# EAGLE design SuperTiny-REV4 (EAGLE 9.5.2)
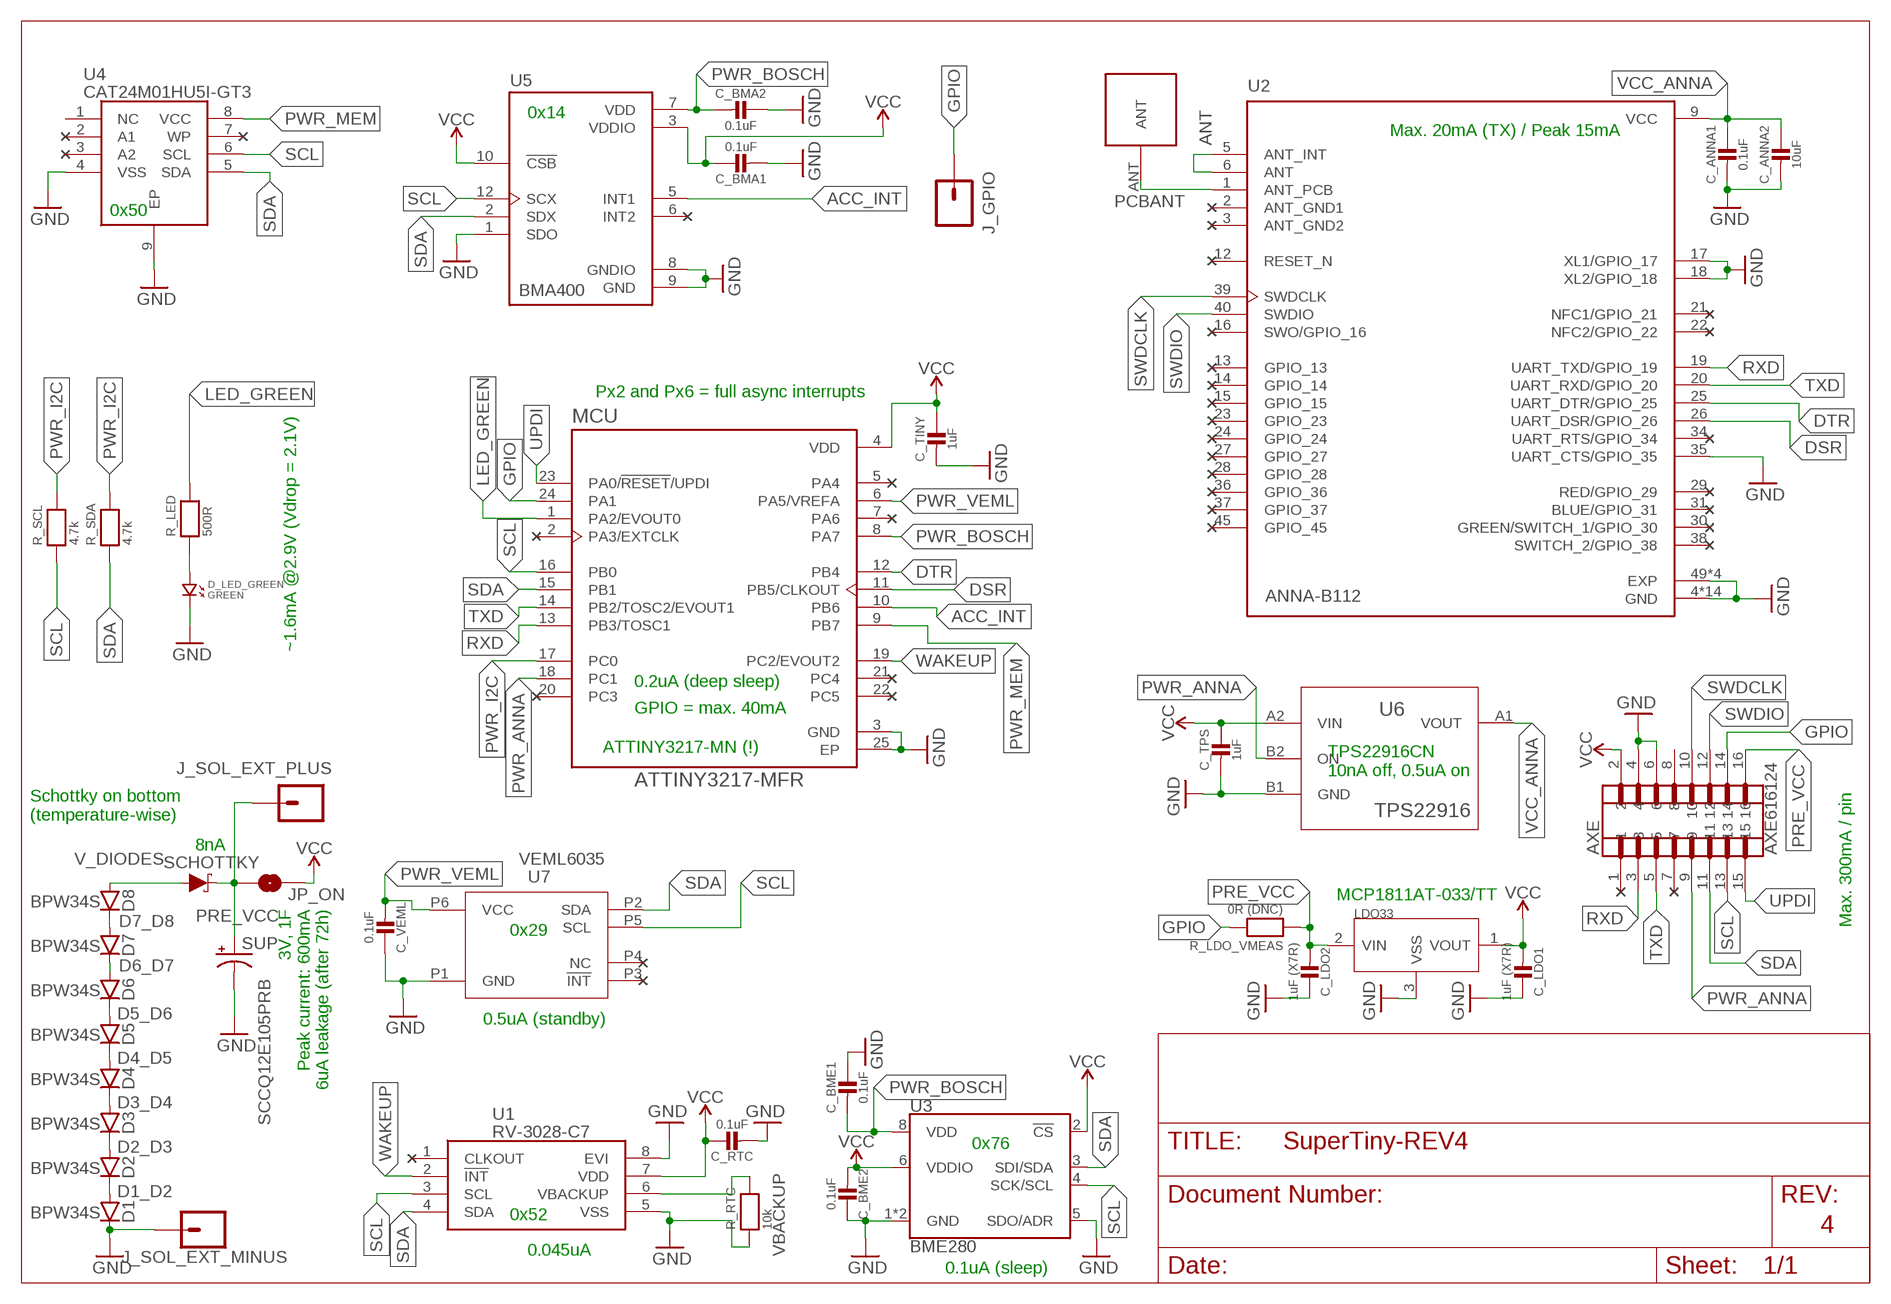
[diagram p0: schematic, sheet 1]

## Parts
AXE  AXE616124  [AXE616124]
C_ANNA1  0.1uF  MICROBUILDER_CAP_CERAMIC_0402MP  [MICROBUILDER__0402MP]
C_ANNA2  10uF  MICROBUILDER_CAP_CERAMIC_0402MP  [MICROBUILDER__0402MP]
C_BMA1  0.1uF  MICROBUILDER_CAP_CERAMIC_0402MP  [MICROBUILDER__0402MP]
C_BMA2  0.1uF  MICROBUILDER_CAP_CERAMIC_0402MP  [MICROBUILDER__0402MP]
C_BME1  0.1uF  MICROBUILDER_CAP_CERAMIC_0402MP  [MICROBUILDER__0402MP]
C_BME2  0.1uF  MICROBUILDER_CAP_CERAMIC_0402MP  [MICROBUILDER__0402MP]
C_LDO1  1uF (X7R)  MICROBUILDER_CAP_CERAMIC_0402MP  [MICROBUILDER__0402MP]
C_LDO2  1uF (X7R)  MICROBUILDER_CAP_CERAMIC_0402MP  [MICROBUILDER__0402MP]
C_RTC  0.1uF  MICROBUILDER_CAP_CERAMIC_0402MP  [MICROBUILDER__0402MP]
C_TINY  1uF  MICROBUILDER_CAP_CERAMIC_0402MP  [MICROBUILDER__0402MP]
C_TPS  1uF  MICROBUILDER_CAP_CERAMIC_0402MP  [MICROBUILDER__0402MP]
C_VEML  0.1uF  MICROBUILDER_CAP_CERAMIC_0402MP  [MICROBUILDER__0402MP]
D1  BPW34S  [BPW34S]
D2  BPW34S  [BPW34S]
D3  BPW34S  [BPW34S]
D4  BPW34S  [BPW34S]
D5  BPW34S  [BPW34S]
D6  BPW34S  [BPW34S]
D7  BPW34S  [BPW34S]
D8  BPW34S  [BPW34S]
D_LED_GREEN  GREEN  CMONR_STANDARDPARTS_LED.0402  [CMONR_STANDARDPARTS_0402.LED]
J_GPIO  CONN_01PTH_NO_SILK_SMALL  [1X01_SMALL]
J_SOL_EXT_MINUS  CONN_01PTH_NO_SILK_SMALL  [1X01_SMALL]
J_SOL_EXT_PLUS  CONN_01PTH_NO_SILK_SMALL  [1X01_SMALL]
JP_ON  JUMPER-SMT_2_NO_NO-SILK  [SMT-JUMPER_2_NO_NO-SILK]
LDO33  MCP1812BT-018LB  [SOT-23]
MCU  ATTINY3217-MFR  [QFN50P400X400X90-25N]
R_LDO_VMEAS  0R (DNC)  MICROBUILDER_RESISTOR_0402MP  [MICROBUILDER__0402MP]
R_LED  500R  MICROBUILDER_RESISTOR_0402MP  [MICROBUILDER__0402MP]
R_RTC  10k  MICROBUILDER_RESISTOR_0402MP  [MICROBUILDER__0402MP]
R_SCL  4.7k  MICROBUILDER_RESISTOR_0402MP  [MICROBUILDER__0402MP]
R_SDA  4.7k  MICROBUILDER_RESISTOR_0402MP  [MICROBUILDER__0402MP]
SCHOTTKY  NSR0140P2T5G  [NSR0140P2T5G]
SUP  SCCQ12E105PRB  [SCCQ12E105PRB]
U1  RV-3028-C7  [RV3028C7]
U2  ANNA-B112  [XCVR_ANNA-B112]
U3  BME280  [LGA-8-2.5X2.5]
U4  CAT24M01HU5I-GT3  [SON50P300X200X55-9N]
U5  BMA400  [XDCR_BMA400]
U6  TPS22916  [TPS22916]
U7  VEML6035  [VEML6035]
U$4  ANNA-B112-PCB-ANTENNA  [ANNA-B112-PCB-ANTENNA]

## Nets
ACC_INT: MCU.10(PB6) U5.5(INT1)
ANT: U2.5(ANT_INT) U2.6(ANT)
D1_D2: D1.PLUS D2.MINUS
D2_D3: D2.PLUS D3.MINUS
D3_D4: D3.PLUS D4.MINUS
D4_D5: D4.PLUS D5.MINUS
D5_D6: D5.PLUS D6.MINUS
D6_D7: D6.PLUS D7.MINUS
D7_D8: D7.PLUS D8.MINUS
DSR: MCU.11(PB5/CLKOUT) U2.26(UART_DSR/GPIO_26)
DTR: MCU.12(PB4) U2.25(UART_DTR/GPIO_25)
GND: AXE.4 AXE.6 C_ANNA1.2 C_ANNA2.2 C_BMA1.2 C_BMA2.1 C_BME1.1 C_BME2.1 C_LDO1.1 C_LDO2.1 C_RTC.2 C_TINY.2 C_TPS.2 C_VEML.1 D1.MINUS D_LED_GREEN.P$2 J_SOL_EXT_MINUS.P$1 LDO33.3(VSS) MCU.3(GND) MCU.25(EP) R_RTC.1 SUP.MINUS(-) U1.5(VSS) U1.8(EVI) U2.4(GND) U2.7(GND) U2.8(GND) U2.10(GND) U2.11(GND) U2.17(XL1/GPIO_17) U2.18(XL2/GPIO_18) U2.32(GND) U2.33(GND) U2.35(UART_CTS/GPIO_35) U2.41(GND) U2.42(GND) U2.43(GND) U2.44(GND) U2.46(GND) U2.47(GND) U2.48(GND) U2.49(EXP) U2.50(EXP) U2.51(EXP) U2.52(EXP) U3.1(GND) U3.5(SDO/ADR) U3.7(GND) U4.4(VSS) U4.9(EP) U5.1(SDO) U5.8(GNDIO) U5.9(GND) U6.B1(GND) U7.P1(GND)
GPIO: AXE.14 J_GPIO.P$1 MCU.24(PA1) R_LDO_VMEAS.2
LED_GREEN: MCU.1(PA2/EVOUT0) R_LED.2
N$9: D_LED_GREEN.P$1 R_LED.1
PCBANT: U2.1(ANT_PCB) U$4.ANT
PRE_VCC: AXE.16 C_LDO2.2 J_SOL_EXT_PLUS.P$1 JP_ON.1 LDO33.2(VIN) R_LDO_VMEAS.1 SCHOTTKY.P$2(CA) SUP.PLUS(+)
PWR_ANNA: AXE.9 MCU.18(PC1) U6.B2(ON)
PWR_BOSCH: C_BMA2.2 C_BME1.2 MCU.8(PA7) U3.8(VDD) U5.7(VDD)
PWR_I2C: MCU.17(PC0) R_SCL.2 R_SDA.2
PWR_MEM: MCU.9(PB7) U4.8(VCC)
PWR_VEML: C_VEML.2 MCU.6(PA5/VREFA) U7.P6(VCC)
RXD: AXE.3 MCU.13(PB3/TOSC1) U2.19(UART_TXD/GPIO_19)
SCL: AXE.13 MCU.16(PB0) R_SCL.1 U1.3(SCL) U3.4(SCK/SCL) U4.6(SCL) U5.12(SCX) U7.P5(SCL)
SDA: AXE.11 MCU.15(PB1) R_SDA.1 U1.4(SDA) U3.3(SDI/SDA) U4.5(SDA) U5.2(SDX) U7.P2(SDA)
SWDCLK: AXE.10 U2.39(SWDCLK)
SWDIO: AXE.12 U2.40(SWDIO)
TXD: AXE.5 MCU.14(PB2/TOSC2/EVOUT1) U2.20(UART_RXD/GPIO_20)
UPDI: AXE.15 MCU.23(PA0/!RESET!/UPDI)
V_DIODES: D8.PLUS SCHOTTKY.P$1(AN)
VBACKUP: R_RTC.2 U1.6(VBACKUP)
VCC: AXE.2 C_BMA1.1 C_BME2.2 C_LDO1.2 C_RTC.1 C_TINY.1 C_TPS.1 JP_ON.2 LDO33.1(VOUT) MCU.4(VDD) U1.7(VDD) U3.2(!CS) U3.6(VDDIO) U5.3(VDDIO) U5.10(!CSB) U6.A2(VIN)
VCC_ANNA: C_ANNA1.1 C_ANNA2.1 U2.9(VCC) U6.A1(VOUT)
WAKEUP: MCU.19(PC2/EVOUT2) U1.2(!INT)
Unconnected: AXE.1 AXE.7 AXE.8 MCU.2(PA3/EXTCLK) MCU.5(PA4) MCU.7(PA6) MCU.20(PC3) MCU.21(PC4) MCU.22(PC5) U1.1(CLKOUT) U2.12(RESET_N) U2.13(GPIO_13) U2.14(GPIO_14) U2.15(GPIO_15) U2.16(SWO/GPIO_16) U2.21(NFC1/GPIO_21) U2.22(NFC2/GPIO_22) U2.23(GPIO_23) U2.24(GPIO_24) U2.27(GPIO_27) U2.28(GPIO_28) U2.29(RED/GPIO_29) U2.30(GREEN/SWITCH_1/GPIO_30) U2.31(BLUE/GPIO_31) U2.34(UART_RTS/GPIO_34) U2.36(GPIO_36) U2.37(GPIO_37) U2.38(SWITCH_2/GPIO_38) U2.45(GPIO_45) U4.1(NC) U4.2(A1) U4.3(A2) U4.7(WP) U5.6(INT2) U7.P3(!INT) U7.P4(NC)

## Notes on the sheet
- 0x14
- Max. 20mA (TX) / Peak 15mA
- 0x50
- Px2 and Px6 = full async interrupts
- ~1.6mA @2.9V (Vdrop = 2.1V)
- 0.2uA (deep sleep)
- GPIO = max. 40mA
- ATTINY3217-MN (!)
- TPS22916CN
  10nA off, 0.5uA on
- Schottky on bottom
  (temperature-wise)
- 8nA
- MCP1811AT-033/TT
- 3V, 1F
  Peak current: 600mA
  6uA leakage (after 72h)
- Max. 300mA / pin
- 0x29
- 0.5uA (standby)
- 0x76
- 0x52
- 4
- 0.045uA
- 0.1uA (sleep)

## Power pins joined to a net without a drawn wire
ANT_GND1: U2.2(ANT_GND1)
ANT_GND2: U2.3(ANT_GND2)

## Library data of the parts
AXE = PanasonicA4SConnectorsV7:AXE616124
C_ANNA1 C_ANNA2 C_BME1 C_BME2 C_LDO1 C_LDO2 C_TINY C_TPS C_VEML = TinyPICO:MICROBUILDER_CAP_CERAMIC: Ceramic Capacitors For new designs, use the packages preceded by an '_' character since they are more reliable: The following footprints should be used on most boards: _0402 - Standard footprint for regular board layouts _0603 - Standard footprint for regular board layouts _0805 - Standard footprint for regular board layouts _1206 - Standard footprint for regular board layouts For extremely tight-pitch boards where space is at a premium, the following 'micro-pitch' footprints can be used (smaller pads, no silkscreen outline, etc.): _0402MP - Micro-pitch footprint for very dense/compact boards _0603MP - Micro-pitch footprint for very dense/compact boards _0805MP - Micro-pitch footprint for very dense/compact boards _1206MP - Micro-pitch footprint for very dense/compact boards
C_BMA1 C_BMA2 C_RTC = TinyPICO:MICROBUILDER_CAP_CERAMIC: Ceramic Capacitors For new designs, use the packages preceded by an '_' character since they are more reliable: The following footprints should be used on most boards: _0402 - Standard footprint for regular board layouts _0603 - Standard footprint for regular board layouts _0805 - Standard footprint for regular board layouts _1206 - Standard footprint for regular board layouts For extremely tight-pitch boards where space is at a premium, the following 'micro-pitch' footprints can be used (smaller pads, no silkscreen outline, etc.): _0402MP - Micro-pitch footprint for very dense/compact boards _0603MP - Micro-pitch footprint for very dense/compact boards _0805MP - Micro-pitch footprint for very dense/compact boards _1206MP - Micro-pitch footprint for very dense/compact boards; SPICEPREFIX: C
D1-D8 = TimmOsramBPW34SV3:BPW34S
D_LED_GREEN = TinyPICO:CMONR_STANDARDPARTS_LED
J_GPIO J_SOL_EXT_MINUS J_SOL_EXT_PLUS = SparkFun-Connectors:CONN_01: Single connection point. Often used as Generic Header-pin footprint for 0.1 inch spaced/style header connections On any of the 0.1 inch spaced packages, you can populate with these: Break Away Headers - Straight <https://www.sparkfun.com/products/116> (PRT-00116) Break Away Male Headers - Right Angle <https://www.sparkfun.com/products/553> (PRT-00553) Female Headers <https://www.sparkfun.com/products/115> (PRT-00115) Break Away Headers - Machine Pin <https://www.sparkfun.com/products/117> (PRT-00117) Break Away Female Headers - Swiss Machine Pin <https://www.sparkfun.com/products/743> (PRT-00743) This device is also useful as a general connection point to wire up your design to another part of your project. Our various solder wires solder well into these plated through hole pads. Hook-Up Wire - Assortment (Stranded, 22 AWG) <https://www.sparkfun.com/products/11375> (PRT-11375) Hook-Up Wire - Assortment (Solid Core, 22 AWG) <https://www.sparkfun.com/products/11367> (PRT-11367) View the entire wire category on our website here <https://www.sparkfun.com/categories/141> Special notes: SMTSO-256-ET is a "flush mount" nut for a 4-40 screw. We mostly use this on specialty testbeds; it is a nice way to connect hardware to your PCB at an adjustable hieght. Also note, the SNAP packages are for using a snappable style connector. We sell a baggie of snaps and they are also used on two LilyPad designs: Snap Assortment - 30 pack (male and female) <https://www.sparkfun.com/products/11347> (DEV-11347) LilyPad Arduino SimpleSnap <https://www.sparkfun.com/products/10941> (DEV-10941) LilyPad SimpleSnap Protoboard <https://www.sparkfun.com/products/10940> (DEV-10940)
JP_ON = SparkFun-Jumpers-NoCreamV2:JUMPER-SMT_2_NO: Normally open jumper This jumper has two pads in close proximity to each other. Apply solder to close the connection. Round pads are easier to solder for beginners, but are a lot larger. SparkFun Product that uses the round pads: SparkFun EL Sequencer <https://www.sparkfun.com/products/12781>
LDO33 = MCP1812BT-018LB_SOT23_3_V3:MCP1812BT-018LB: 310030099; AVAILABILITY: Unavailable; DESCRIPTION: Linear Voltage Regulator IC 1 Output 200mA SOT-23; MF: Torex; MP: XC6206P332MR-G; PACKAGE: SOT-23-3 Torex; PRICE: None
MCU = ATTINY3217-MFR-V2:ATTINY3217-MFR: 20MHZ, 32KB, QFN24, Ind 125C, Green, T&r Check prices <https://snapeda.com/parts/ATTINY3217-MFR/Microchip/view-part/?ref=eda>; ARROW_ELECTRONICS-PURCHASE-URL: https://snapeda.com/shop?store=Arrow+Electronics&id=2873095; AVAILABILITY: Good; DESCRIPTION: AVR tinyAVR™ 1 Microcontroller IC 8-Bit 20MHz 32KB (32K x 8) FLASH 24-VQFN (4x4); DIGIKEY-PURCHASE-URL: https://snapeda.com/shop?store=DigiKey&id=2873095; MF: Microchip; MOUSER-PURCHASE-URL: https://snapeda.com/shop?store=Mouser&id=2873095; MP: ATTINY3217-MFR; PACKAGE: VFQFN-24 Microchip; PRICE: None
R_LDO_VMEAS R_LED R_RTC R_SCL R_SDA = TinyPICO:MICROBUILDER_RESISTOR: Resistors 0402 - 0402 Surface Mount Package 22 Ohm 1% 1/16W [Digikey: 311-22.0LRTR-ND] 33 Ohm 5% 1/16W 1.0K 5% 1/16W 1.5K 5% 1/16W 2.0K 1% 1/16W 10.0K 1% 1/16W [Digikey: 311-10.0KLRTR-ND] 10.0K 5% 1/16W [Digikey: RMCF0402JT10K0TR-ND] 12.1K 1% 1/16W [Digikey: 311-22.0LRTR-ND] 100.0K 5% 1/16W 0603 - 0603 Surface Mount Package 0 Ohm 1/10 Watt 1% Resistor 15 Ohm 1/10 Watt 1% Resistor 33 Ohm 1/10 Watt 1% Resistor 49.9 Ohm 1/10 Watt 1% Resistor 100 Ohm 1/10 Watt 1% Resistor 150 Ohm 1/10 Watt 1% Resistor 240 Ohm 1/10 Watt 1% Resistor 390 Ohm 1/10 Watt 1% Resistor 560 Ohm 1/10 Watt 1% Resistor 680 Ohm 1/10 Watt 1% Resistor 750 Ohm 1/10 Watt 1% Resistor 1.0K Ohm 1/10 Watt 1% Resistor 1.5K Ohm 1/10 Watt 1% Resistor 2.0K Ohm 1/10 Watt 1% Resistor 2.2K Ohm 1/10 Watt 1% Resistor 3.3K Ohm 1/10 Watt 1% Resistor 4.7K Ohm 1/10 Watt 1% Resistor 10.0K Ohm 1/10 Watt 1% Resistor 12.0K Ohm 1/10 Watt 1% Resistor 12.1K Ohm 1/10 Watt 1% Resistor 20.0K Ohm 1/10 Watt 1% Resistor 33.0K Ohm 1/10 Watt 1% Resistor 100.0K Ohm 1/10 Watt 1% Resistor 0805 - 0805 Surface Mount Package 0 Ohm 1/8 Watt 1% Resistor 33 Ohm 1/8 Watt 1% Resistor 100 Ohm 1/8 Watt 1% Resistor 150 Ohm 1/8 Watt 1% Resistor 200 Ohm 1/8 Watt 1% Resistor 240 Ohm 1/8 Watt 1% Resistor 330 Ohm 1/8 Watt 1% Resistor 390 Ohm 1/8 Watt 1% Resistor 470 Ohm 1/8 Watt 1% Resistor 1.0K Ohm 1/8 Watt 1% Resistor 1.5K Ohm 1/8 Watt 1% Resistor 2.0K Ohm 1/8 Watt 1% Resistor 4.7K Ohm 1/8 Watt 1% Resistor 5.1K Ohm 1/8 Watt 1% Resistor 5.6K Ohm 1/8 Watt 1% Resistor 10.0K Ohm 1/8 Watt 1% Resistor 22.0K Ohm 1/8 Watt 1% Resistor 33.0K Ohm 1/8 Watt 1% Resistor 100K Ohm 1/8 Watt 1% Resistor 1206 - 1206 Surface Mount Package 2012 - 2010 Surface Mount Package 0.11 Ohm 1/2 Watt 1% Resistor - Digikey: RHM.11UCT-ND
SCHOTTKY = NSR0140P2T5G:NSR0140P2T5G
SUP = AvxSupercapsV3:SCCQ12E105PRB
U1 = RV-3028-C7:RV-3028-C7: Extreme Low Power RTC Module Source: Datasheet <http://www.microcrystal.com/images/_Product-Documentation/02_Oscillator_&_RTC_Modules/01_Datasheet/RV-3028-C7.pdf>; DESCRIPTION: Extreme Low Power RTC Module; HEIGHT: 0mm; MANUFACTURER_NAME: Micro Crystal AG; MANUFACTURER_PART_NUMBER: RV-3028-C7; SPICEPREFIX: X
U2 = ANNA-B112V3:ANNA-B112: Stand-alone Bluetooth® 5 low energy module packed into a System-in-Package design. Despite the small size, ANNA-B112 offers the internal antenna option.; AVAILABILITY: Unavailable; DESCRIPTION: Bluetooth Bluetooth v5.0 Transceiver Module 2.4GHz Surface Mount; MF: U-Blox America; MP: ANNA-B112; PACKAGE: SMD-52 U-Blox America; PRICE: None
U3 = SparkFun-SensorsV2:BME280: Bosch BME280 – Combined Humidity and Pressure Sensor The BME280 is as combined digital humidity, pressure and temperature sensor based on proven sensing principles. The sensor module is housed in an extremely compact metal-lid LGA package with a footprint of only 2.5×2.5mm² with a height of 0.93mm. Its small dimensions and its low power consumption allow the implementation in battery driven devices such as handsets, GPS modules or watches. Datasheet <https://cdn.sparkfun.com/assets/learn_tutorials/4/1/9/BST-BME280_DS001-10.pdf> SparkFun Products SparkFun Atmospheric Sensor Breakout - BME280 <https://www.sparkfun.com/products/13676> (SEN-13676); PROD_ID: IC-13090
U4 = CAT24M01HU5I-GT3-CorrectedV2:CAT24M01HU5I-GT3: EEPROM 1MB I2C SERIAL EEPROM Source: Datasheet <http://www.onsemi.com/pub/Collateral/CAT24M01-D.PDF>; ALLIED_NUMBER: 70300250; ALLIED_PRICE-STOCK: http://www.alliedelec.com/on-semiconductor-cat24m01hu5i-gt3/70300250/; DESCRIPTION: EEPROM 1MB I2C SERIAL EEPROM; HEIGHT: 0.55mm; MANUFACTURER_NAME: ON Semiconductor; MANUFACTURER_PART_NUMBER: CAT24M01HU5I-GT3; MOUSER_PART_NUMBER: 863-CAT24M01HU5I-GT3; MOUSER_PRICE-STOCK: https://www.mouser.com/Search/Refine.aspx?Keyword=863-CAT24M01HU5I-GT3; RS_PART_NUMBER: 7814831P; RS_PRICE-STOCK: http://uk.rs-online.com/web/p/products/7814831P
U5 = BMA400V3:BMA400: Ultra low power, 12-bit digital triaxial accelerometer; AVAILABILITY: Unavailable; DESCRIPTION: Accelerometer X, Y, Z Axis ±2g, 4g, 8g, 16g 12-LGA (2x2); MF: Bosch Sensortec; MP: BMA400; PACKAGE: LGA-12 Bosch Tools; PRICE: None
U6 = TPS22916V2:TPS22916: Linear Regulator; AVAILABILITY: Unavailable; DESCRIPTION: Linear Voltage Regulator IC 1 Output 150mA 4-DSBGA (1x1); MF: Texas Instruments; MP: LP5900TL-3.0; PACKAGE: WFBGA-4 Texas Instruments; PRICE: None
U7 = VEML6035V2:VEML6035; PROD_ID: SEN-14447
U$4 = ANNA-B112V2:ANNA-B112-PCB-ANTENNA

## Board
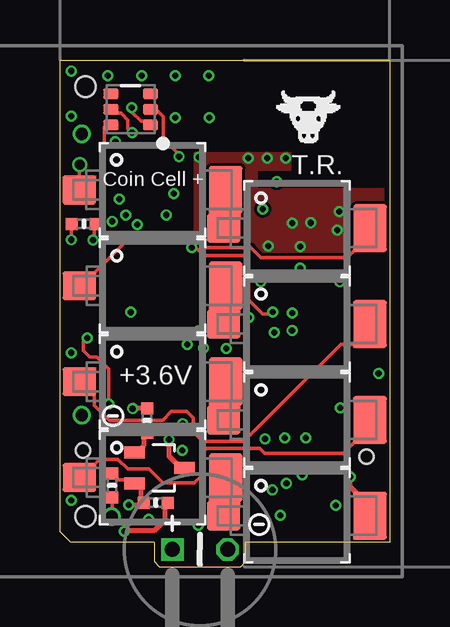
[diagram p1: board, top side]
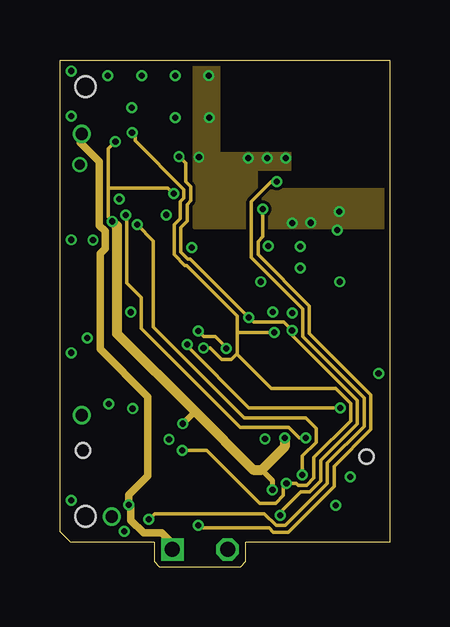
[diagram p2: board, inner layer POWER]
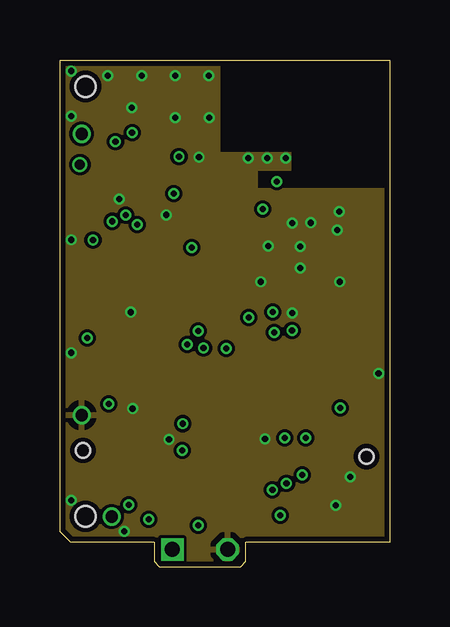
[diagram p3: board, inner layer GND]
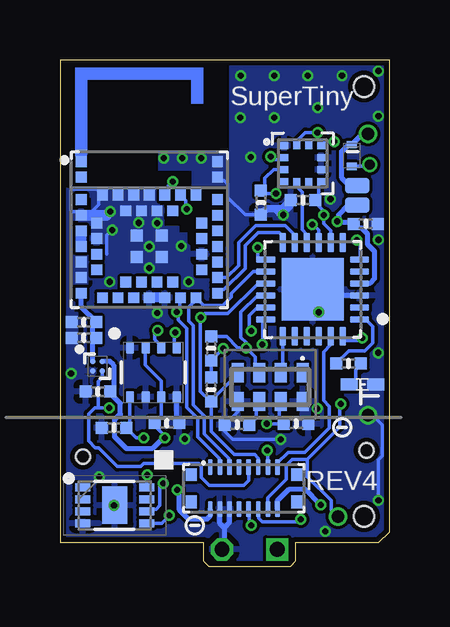
[diagram p4: board, bottom side, seen from below]

Size 13.73 x 21.13 mm. Coordinates in mm from the lower left corner, seen from the top.
Outline: 0,21.13 13.73,21.13 13.73,1.01 7.74,1.01 7.74,0.22 7.52,0 4.14,0 3.92,0.22 3.92,1.01 0.45,1.01 0,1.46 0,21.13
Copper layers (1+2*15+16): Top 0.0356mm / dielectric 0.1702mm / POWER 0.0178mm / dielectric 47mil / GND 0.0178mm / dielectric 0.1702mm / Bottom 0.0356mm
Design rules "default *": minimum track width 5mil, minimum drill 10mil, track to track 5mil, track to pad 5mil, pad to pad 5mil, via to via 5mil, smd to smd 5mil, copper to edge 9mil, drill to drill 6mil, minimum pad ring 4mil, minimum via ring 4mil, stop-mask expansion 0mil, vias tented up to drill 12mil, thermal gap 10mil
Holes 0.85 mm at 1.06,2.1 1.06,20.02
Holes 0.6 mm at 0.96,4.85 12.77,4.59

### Footprints (pad centres in the part's own frame; a part is rotated, then mirrored left to right if it is on the bottom)
AXE616124 = smd 0.2 x 0.65: 1 1.4,-0.88; 2 1.4,0.87; 3 1,-0.88; 4 1,0.87; 5 0.6,-0.88; 6 0.6,0.87; 7 0.2,-0.88; 8 0.2,0.87; 9 -0.2,-0.88; 10 -0.2,0.87; 11 -0.6,-0.88; 12 -0.6,0.87; 13 -1,-0.88; 14 -1,0.87; 15 -1.4,-0.88; 16 -1.4,0.87 | smd 0.45 x 0.53: DNC1 -2.2,0.57; DNC2 -2.2,-0.569; DNC3 2.197,-0.569; DNC4 2.197,0.57
MICROBUILDER__0402MP = smd 0.5 x 0.5: 1 -0.508,0; 2 0.508,0
BPW34S = smd 1.4 x 2: MINUS 5.3,2 | smd 1.4 x 1.2: PLUS -0.8,2
CMONR_STANDARDPARTS_0402.LED = smd 0.7 x 0.5: P$1 -0.55,0; P$2 0.55,0
1X01_SMALL = drill 0.508: P$1 0,0
SMT-JUMPER_2_NO_NO-SILK = smd 0.635 x 1.016: 1 -0.406,0; 2 0.406,0
SOT-23 = smd 0.5 x 0.85: 1 -0.65,-1.01; 2 0.65,-1.01; 3 0,1.06
QFN50P400X400X90-25N = smd 0.81 x 0.26: 1 -1.95,1.25; 2 -1.95,0.75; 3 -1.95,0.25; 4 -1.95,-0.25; 5 -1.95,-0.75; 6 -1.95,-1.25; 13 1.95,-1.25; 14 1.95,-0.75; 15 1.95,-0.25; 16 1.95,0.25; 17 1.95,0.75; 18 1.95,1.25 | smd 0.26 x 0.81: 7 -1.25,-1.95; 8 -0.75,-1.95; 9 -0.25,-1.95; 10 0.25,-1.95; 11 0.75,-1.95; 12 1.25,-1.95; 19 1.25,1.95; 20 0.75,1.95; 21 0.25,1.95; 22 -0.25,1.95; 23 -0.75,1.95; 24 -1.25,1.95 | smd 2.6 x 2.6: 25 0,0
NSR0140P2T5G = smd 0.3 x 0.4: P$1 0.45,0; P$2 -0.45,0
SCCQ12E105PRB = drill 0.62 pad 0.9 octagon: MINUS 1.15,0 | drill 0.62 pad 0.9 square: PLUS -1.15,0
RV3028C7 = smd 0.5 x 0.8: 1 -1.35,-0.6; 2 -0.45,-0.6; 3 0.45,-0.6; 4 1.35,-0.6; 5 1.35,0.6; 6 0.45,0.6; 7 -0.45,0.6; 8 -1.35,0.6
XCVR_ANNA-B112 = smd 0.45 x 0.45: 1 -2.84,2.84; 2 -2.84,2.19; 3 -2.84,1.248; 4 -2.84,0.598; 5 -2.84,-0.052; 6 -2.84,-0.702; 7 -2.84,-1.352; 8 -2.84,-2.002; 9 -2.84,-2.652; 10 -2.19,0.273; 11 -2.19,-0.377; 12 -2.19,-1.027; 13 -2.19,-1.677; 14 -1.95,-2.84; 15 -1.3,-2.84; 16 -0.65,-2.84; 17 0,-2.84; 18 0.65,-2.84; 19 1.3,-2.84; 20 1.95,-2.84; 21 -0.975,-2.19; 22 -0.325,-2.19; 23 0.325,-2.19; 24 0.975,-2.19; 25 2.84,-2.652; 26 2.84,-2.002; 27 2.84,-1.352; 28 2.84,-0.702; 29 2.84,-0.052; 30 2.84,0.598; 31 2.84,1.248; 32 2.84,2.19; 33 2.84,2.84; 34 2.19,-1.677; 35 2.19,-1.027; 36 2.19,-0.377; 37 2.19,0.273; 38 1.95,1.435; 39 1.3,1.435; 40 0.65,1.435; 41 0,1.435; 42 -0.65,1.435; 43 -1.3,1.435; 44 -1.95,1.435; 45 0.975,0.785; 46 0.325,0.785; 47 -0.325,0.785; 48 -0.975,0.785 | smd 0.5 x 0.5: 49 -0.52,-0.252; 50 -0.52,-1.152; 51 0.52,-0.252; 52 0.52,-1.152
LGA-8-2.5X2.5 = smd 0.35 x 0.5: 1 -0.975,1.025; 2 -0.325,1.025; 3 0.325,1.025; 4 0.975,1.025; 5 0.975,-1.025; 6 0.325,-1.025; 7 -0.325,-1.025; 8 -0.975,-1.025
SON50P300X200X55-9N = smd 0.63 x 0.32: 1 -1.33,0.75; 2 -1.33,0.25; 3 -1.33,-0.25; 4 -1.33,-0.75; 5 1.33,-0.75; 6 1.33,-0.25; 7 1.33,0.25; 8 1.33,0.75 | smd 1.06 x 1.56: 9 0,0
XDCR_BMA400 = smd 0.35 x 0.3: 1 -0.775,0.75; 2 -0.775,0.25; 3 -0.775,-0.25; 4 -0.775,-0.75; 7 0.775,-0.75; 8 0.775,-0.25; 9 0.775,0.25; 10 0.775,0.75 | smd 0.3 x 0.35: 5 -0.25,-0.775; 6 0.25,-0.775; 11 0.25,0.775; 12 -0.25,0.775
TPS22916 = smd 0.23 x 0.23: A1 -0.254,0.254; A2 0.144,0.254; B1 -0.254,-0.144; B2 0.144,-0.144
VEML6035 = smd 0.65 x 0.45: P1 -0.83,0.65; P2 -0.83,0; P3 -0.83,-0.65; P4 0.82,-0.65; P5 0.82,0; P6 0.82,0.65
ANNA-B112-PCB-ANTENNA = smd 0.5 x 0.1: ANT 0.25,0.05

### Placement (x,y rotation side)
AXE  6.07,3.27 180 bottom
C_ANNA1  12.73,10.2 180 bottom
C_ANNA2  12.73,9.54 180 bottom
C_BMA1  5.36,15.18 270 bottom
C_BMA2  3.61,15.29 0 bottom
C_BME1  11.48,5.79 0 bottom
C_BME2  9.28,5.98 180 bottom
C_LDO1  3.63,6.09 270 top
C_LDO2  3.99,2.67 180 top
C_RTC  3.89,5.96 0 bottom
C_TINY  0.99,14.29 0 bottom
C_TPS  12.15,7.3 180 bottom
C_VEML  0.99,14.29 0 top
D1  7.62,0.12 0 top
D2  1.6,1.72 0 top
D3  7.62,4.12 0 top
D4  1.6,5.71 0 top
D5  7.62,8.12 0 top
D6  1.6,9.71 0 top
D7  7.62,12.12 0 top
D8  1.6,13.71 0 top
D_LED_GREEN  1.13,7.6 0 bottom
J_GPIO  2.15,2.09 0 top
J_SOL_EXT_MINUS  0.9,6.32 0 top
J_SOL_EXT_PLUS  0.9,18.05 0 top
JP_ON  1.34,15.48 270 bottom
LDO33  4.12,4.12 270 top
MCU  3.2,11.56 180 bottom
R_LDO_VMEAS  2.17,3.39 270 top
R_LED  1.71,8.47 180 bottom
R_RTC  6.36,5.92 0 bottom
R_SCL  7.43,9.1 270 bottom
R_SDA  7.43,7.39 90 bottom
SCHOTTKY  1.57,17.15 270 bottom
SUP  5.83,0.72 0 top
U1  4.97,7.48 180 bottom
U2  10.01,14.05 0 bottom
U3  9.84,8.1 0 bottom
U4  11.45,2.56 0 bottom
U5  3.62,16.81 0 bottom
U6  12.12,8.31 0 bottom
U7  2.94,19.07 180 top
U$4  13.1,17.3 0 bottom

### Tracks (layer width: path | path; a pad name or v marks a point on that pad's centre or on a via)
ACC_INT
  Bottom 0.152: U5.5 3.8,15.96 3.8,15.78 3.65,15.63 3.65,14.05 3.45,13.86 MCU.10
ANT
  Bottom 0.45: U2.6 U2.5
D1_D2
  Top 0.406: D1.PLUS 6.91,2.21 D2.MINUS
D2_D3
  Top 0.152: D3.MINUS 12.91,5.85 11.79,4.73 8.53,4.73 8.32,4.94 6.11,4.94 5.88,4.71 5.88,3.78 5.59,3.49 4.27,3.49 3.69,4.07 2.81,4.07 2.41,4.47 1.65,4.47 0.9,3.72 D2.PLUS
D3_D4
  Top 0.406: D3.PLUS 6.91,6.21 D4.MINUS
D4_D5
  Top 0.152: D5.MINUS 12.91,9.26 11.7,9.26 7.66,5.22 5.95,5.22 5.55,5.62 5.55,6.2 5.28,6.47 4.64,6.47 4.27,6.11 2.04,6.11 1.43,6.73 1.43,7.2 0.92,7.71 D4.PLUS
D5_D6
  Top 0.406: D5.PLUS 6.91,10.21 D6.MINUS
D6_D7
  Top 0.152: D7.MINUS 12.56,13.76 12.56,13.49 11.97,12.9 8.37,12.9 7.95,13.32 6.04,13.32 5.89,13.47 5.89,13.59 5.75,13.73 2.91,13.73 0.9,11.71 D6.PLUS
D7_D8
  Top 0.406: D7.PLUS 6.9,14.2 D8.MINUS
DSR
  Bottom 0.152: MCU.11 3.99,13.55 3.99,13.87 4.33,14.22 5.58,14.22 6.29,13.51 6.29,12.56 6.8,12.05 U2.26
DTR
  Bottom 0.152: U2.25 7.01,11.55 6.9,11.55 6.01,12.44 6.01,13.39 5.47,13.93 4.59,13.93 4.45,13.79 MCU.12
GND  (via drill 0.25)
  Top 0.152: D1.MINUS 12.91,2.5 | U7.P1 3.62,18.57 3.38,18.57 2.99,18.96 v2.99,19.14 | v0.46,13.63 0.46,14.27 C_VEML.1
  Top 0.2: 12.91,2.5 12.1,3.32 v12.1,3.74 | C_LDO1.1 v3.03,6.6 v3.02,6.59 | LDO33.3 5.02,4.12 4.54,4.6 v4.54,5.3 | C_LDO2.1 4.36,2.53 4.36,1.93 3.92,1.5 2.71,1.5 v2.68,1.47
  Bottom 0.152: v11.55,14.04 11.77,13.82 11.77,13.04 | U1.5 6.33,6.46 R_RTC.1 6.86,5.64 6.52,5.3 v4.54,5.3 | v0.46,2.76 v0.47,2.77 0.47,4.45 0.3,4.62 0.3,5.92 0.71,6.32 J_SOL_EXT_MINUS.P$1 | U2.32 7.02,16.1 6.88,16.1 6.74,15.95 6.74,15.4 6.01,14.67 C_BMA1.2 | 13.23,15.74 13.28,15.69 13.28,14.86 13.22,14.8 13,14.8 U2.4 12.7,14.8 12.41,14.8 12.12,15.09 12.12,15.33 U2.44 12.2,15.74 13.23,15.74
  Bottom 0.2: AXE.6 6.67,1.85 6.89,1.63 | 6.89,1.63 7.07,1.81 AXE.4 | 6.89,1.63 6.89,1.05 SUP.MINUS | C_BME2.1 8.87,6.08 U3.5 | MCU.3 2.25,11.31 v2.95,10.61
  Bottom 0.254: 4.51,14.92 4.15,15.29 C_BMA2.1 4.12,15.04 4.43,14.72 v4.43,14.67 4.43,14.89 4.6,14.72 4.85,14.97 5.06,14.97 C_BMA1.2
  Bottom 0.305: C_BMA1.2 5.11,14.92 4.51,14.92
  Bottom 0.406: 11.79,14.65 v11.64,14.8 | U2.18 U2.17
  Bottom 0.45: U2.4 11.79,14.65
  other vias: 7.85,17.04 8.64,17.04 9.4,17.04 6.2,20.47 6.22,18.72 10.01,13.35 8.68,13.37 9.68,14.32 10.45,14.34 10.01,12.45 4.8,20.47 3.41,20.47 1.98,20.47 4.8,18.72 2.46,15.33 9.68,10.57 0.47,8.92 0.46,18.78 13.27,8.06 11.48,2.56 8.37,11.88 11.66,11.88 5.79,17.07 8.54,5.33 0.46,20.67
  pour Bottom: -2.25,22.27 -2.25,-0.32 14.78,-0.32 14.78,22.27
  cutout Bottom: 14.07,17.3 6.7,17.3 6.7,21.42 14.07,21.42
  cutout Bottom: 13.61,17.3 13.61,15.8 9.66,15.8 9.66,17.3
  cutout Bottom: 9.66,16.49 8.26,16.49 8.26,15.87 9.66,15.87
  pour Bottom (no thermals): 6.54,17.3 7.91,17.3 7.91,15.87 6.54,15.87
  pour Bottom (no thermals): 9.41,15.07 12.43,15.07 12.43,13.45 11.27,13.45 11.27,12.28 8.78,12.28 8.78,14.22 9.41,14.22
  pour GND: -1.42,21.63 15.72,21.63 15.72,-1.54 -1.42,-1.54
  pour Bottom (no thermals): 13.2,10.61 13.2,15.8 13.5,15.8 13.5,10.61
  pour Bottom (no thermals): 13.22,12.99 12.56,12.99 12.56,11.76 13.22,11.76
  cutout Bottom: 6.82,15.87 8.16,15.87 8.35,15.68 8.35,15.28 8.43,15.2 8.66,15.2 8.75,15.11 8.75,13.96 8.4,13.96 8.4,13.5 8.26,13.36 6.82,13.36
  pour Bottom (no thermals): 9.72,15.8 9.72,15.01 12.43,15.01 12.43,15.8
  pour Bottom (no thermals): 13.05,14.43 13.4,14.43 13.4,14.88 13.05,14.88
  cutout Bottom: 9.31,14.22 8.75,14.22 8.75,14.48 8.79,14.52 9.27,14.52 9.32,14.47 9.37,14.42 9.37,14.22
  cutout GND: 14.07,17.3 6.7,17.3 6.7,21.42 14.07,21.42
  cutout GND: 13.61,17.3 13.61,15.8 9.66,15.8 9.66,17.3
  cutout GND: 9.66,15.8 8.26,15.8 8.26,16.49 9.66,16.49
  pour Bottom (no thermals): 0.23,15.03 0.23,13.43 0.85,13.43 0.85,14.81 0.63,15.03
  pour Bottom (no thermals): 0.23,5.85 0.23,8.76 0.44,8.75 1.52,7.67 1.52,6 1.14,5.62 0.46,5.62
  pour POWER: 5.6,23.4 5.6,14.15 14.67,14.15 14.67,23.4
  cutout POWER: 8.26,15.8 8.26,16.49 9.66,16.49 9.66,17.3 6.7,17.3 6.7,21.3 13.86,21.3 13.87,21.29 13.87,15.8
  pour Top: 5.63,17.23 5.63,12.97 15.05,12.97 15.05,17.23
  cutout Top: 8.26,15.8 8.26,16.49 9.66,16.49 9.66,17.3 6.7,17.3 6.7,21.55 14.25,21.55 14.25,15.8
  pour Bottom (no thermals): 13.21,10.61 13.5,10.61 13.5,8.95 12.98,8.95 12.98,10.61
GPIO  (via drill 0.25)
  Top 0.152: R_LDO_VMEAS.2 2.17,2.11 J_GPIO.P$1 | v2.03,6.78 2.04,6.79 2.04,8.25 1.54,8.75 1.23,8.75 0.96,9.02 0.96,9.37 v1.13,9.54
  Bottom 0.152: v2.03,6.78 2.07,6.74 2.07,5.83 3.42,4.48 | 3.42,4.48 4.05,4.48 4.3,4.23 4.3,3.63 5.07,2.86 AXE.14 | J_GPIO.P$1 2.43,2.37 2.43,2.76 3.42,3.75 3.42,4.48 | MCU.24 1.95,9.51 1.87,9.43 1.24,9.43 v1.13,9.54
LED_GREEN
  Bottom 0.152: MCU.1 1,10.31 0.7,10.01 0.7,9.33 1.02,9 1.7,9 2.21,8.48 R_LED.2
N$9
  Bottom 0.152: R_LED.1 1.2,8.42 1.41,8.2 1.41,7.8 1.61,7.6 D_LED_GREEN.P$1
PCBANT
  Bottom 0.152: U2.1 12.85,17.18 | U$4.ANT 12.85,17.67
  Bottom 0.5: 12.85,17.67 12.85,17.18
PRE_VCC  (via drill 0.25)
  Top 0.152: R_LDO_VMEAS.1 2.45,3.62 2.96,3.62 LDO33.2
  Top 0.2: v2.86,2.58 3.4,2.58 C_LDO2.2 3.36,2.79 3.36,3.3 3.19,3.47 LDO33.2
  POWER 0.305: J_SOL_EXT_PLUS.P$1 0.85,18 0.85,17.68 1.64,16.88 1.64,14.22 1.88,13.98 1.88,13.89 1.88,13.26 1.67,13.05 1.67,9.07 3.65,7.09 3.65,3.79 2.86,3 v2.86,2.58 2.95,2.49 2.95,1.94 3.48,1.41 4.24,1.41 4.68,0.97 SUP.PLUS
  Bottom 0.2: JP_ON.1 1.67,15.89 2.01,16.23 2.01,17.29 1.71,17.6 SCHOTTKY.P$2 1.12,18.05 J_SOL_EXT_PLUS.P$1 | AXE.16 4.67,2.74 4.18,3.23 3.51,3.23 v2.86,2.58
PWR_ANNA  (via drill 0.25)
  POWER 0.152: v5.3,9.26 5.3,9.19 7.87,6.63 v11.68,6.63
  Bottom 0.152: MCU.18 5.26,10.31 5.28,10.29 5.28,9.4 5.3,9.38 v5.3,9.26 | U6.B2 11.98,7.9 12.15,7.73 12.15,6.63 | AXE.9 5.87,3.6 6.07,3.4 7.51,3.4 7.84,3.73 7.84,4.19 7.96,4.31 10.23,4.31 10.36,4.18 11.34,4.18 12.12,4.96 12.26,4.96 12.54,5.24 12.54,6.37 12.28,6.63 12.15,6.63 | 12.15,6.63 v11.68,6.63
PWR_BOSCH  (via drill 0.25)
  POWER 0.152: v2.74,14.65 2.78,14.61 2.78,11.83 3.38,11.23 3.38,9.93 7.51,5.8 9.54,5.8 9.97,5.37 v10.24,5.37
  Bottom 0.152: U5.7 2.94,15.96 2.94,15.44 C_BMA2.2 3.1,15.19 2.74,14.82 v2.74,14.66 v2.74,14.65 2.74,14.31 2.45,14.02 MCU.8 | U3.8 10.81,5.95 C_BME1.2 10.56,5.37 v10.24,5.37
PWR_I2C  (via drill 0.25)
  POWER 0.152: v5.76,9.82 5.98,9.6 6.46,9.6 6.92,9.14 v6.92,9.1
  Bottom 0.152: R_SDA.2 R_SCL.2 v6.92,9.1 | MCU.17 5.51,10.81 5.84,10.48 5.84,9.9 v5.76,9.82
PWR_MEM  (via drill 0.25)
  POWER 0.152: v10.1,3.83 10.1,4.62 10.67,5.19 10.67,5.77 10.23,6.21 7.68,6.21 3.89,9.99 3.89,13.58 v3.21,14.26
  Bottom 0.152: U4.8 10.12,3.81 v10.1,3.83 | MCU.9 2.95,14.04 3.17,14.26 v3.21,14.26
PWR_VEML  (via drill 0.25)
  Top 0.152: v1.37,13.62 1.42,13.67 1.42,14.21 C_VEML.2 1.56,14.36 1.56,14.41 1.85,14.7 1.85,18.34 1.93,18.42 U7.P6
  Bottom 0.152: MCU.6 1.22,12.84 1.22,13.51 1.33,13.62 v1.37,13.62
RXD  (via drill 0.25)
  Top 0.152: v8.87,10.63 8.78,10.54 8.45,10.54 7.87,11.12 7.87,12.77 7.66,12.98 5.98,12.98 5.66,13.3 v5.49,13.3
  Bottom 0.152: U2.19 8.75,11.17 8.75,10.75 v8.87,10.63 8.8,10.56 8.8,10.28 8.45,9.92 8.45,6.63 7.99,6.18 7.99,5.41 7.1,4.52 7.1,4.18 AXE.3 | v5.49,13.3 5.49,12.92 5.37,12.81 MCU.13
SCL  (via drill 0.25)
  Top 0.152: U7.P5 2.27,18.92 2.54,18.92 2.83,18.63 2.83,18.27 v3,18.1
  POWER 0.152: 7.37,8.87 7.39,8.89 7.39,9.76 | 7.37,8.87 7.14,8.64 6.74,8.64 6.25,9.13 v5.98,9.13 | v3,18.1 3.13,17.97 3.13,17.76 5.16,15.73 5.16,15.37 5.01,15.22 5.01,14.52 4.75,14.26 4.75,13.01 5.2,12.56 5.29,12.56 7.39,10.46 7.39,9.76 | v8.93,9.76 7.39,9.76 | 7.37,8.87 8.8,7.43 11.48,7.43 12.11,6.8 12.11,6.08 10.58,4.55 10.58,3.7 10.28,3.4 9.92,3.4 9.84,3.48 v9.44,3.48 9.3,3.34 9.3,2.96 8.98,2.64 8.32,2.64 6.11,4.85 v5.09,4.85
  Bottom 0.152: MCU.16 5.17,11.29 5.51,11.29 6.19,10.61 6.19,9.56 5.98,9.35 v5.98,9.13 | U3.4 8.96,9.22 8.96,9.73 v8.93,9.76 | U4.6 10.04,2.39 9.73,2.39 9.56,2.55 9.56,3.35 v9.44,3.48 | U5.12 3.8,17.66 3.8,17.81 3.51,18.1 v3,18.1 | AXE.13 5.07,4.82 v5.09,4.85 | U1.3 5.61,8.27 5.61,8.76 v5.98,9.13 | R_SCL.1 7.41,9.59 6.78,9.59 6.32,9.13 v5.98,9.13
SDA  (via drill 0.25)
  Top 0.152: U7.P2 3.99,19.07 4.3,18.76 4.3,17.83 4.96,17.17 v4.96,17.1
  POWER 0.152: v9.18,2.15 9.18,2.27 10.03,3.12 10.39,3.12 10.86,3.58 10.86,4.43 12.39,5.96 12.39,6.93 9.67,9.65 v9.67,9.85 9.32,10.2 8.06,10.2 v7.87,10.39 5.42,12.84 5.32,12.84 5.03,13.12 5.03,14.15 5.29,14.4 5.29,15.11 5.44,15.25 5.44,15.85 5.23,16.06 5.23,16.83 v4.96,17.1
  Bottom 0.152: MCU.15 5.19,11.77 5.52,11.77 6.73,10.56 7.7,10.56 v7.87,10.39 7.89,10.37 7.89,7.31 7.46,6.88 R_SDA.1 | v9.67,9.85 9.67,9.83 9.78,9.72 9.78,9.47 9.52,9.21 U3.3 | U4.5 9.5,1.81 9.18,2.13 v9.18,2.15 | v4.96,17.1 4.84,16.98 4.47,16.98 U5.2 | R_SDA.1 7.43,6.93 6.33,8.04 U1.4 | R_SDA.1 7.43,5.64 6.47,4.68 5.62,4.68 5.47,4.52 AXE.11
SWDCLK  (via drill 0.25)
  POWER 0.152: v8.45,14.91 8.45,13.75 8.25,13.55 8.25,13.01 10.39,10.87 10.39,9.71 12.95,7.16 12.95,5.72 11.42,4.19 11.42,3.35 9.5,1.44 8.88,1.44 8.71,1.61 5.87,1.61 v5.76,1.72
  Bottom 0.152: U2.39 8.49,15.27 8.49,14.95 v8.45,14.91 | v5.76,1.72 5.76,1.87 5.85,1.96 5.85,2.38 AXE.10
SWDIO  (via drill 0.25)
  POWER 0.152: v9.04,16.06 8.81,16.06 7.97,15.22 7.97,12.89 10.11,10.75 10.11,9.6 12.67,7.05 12.67,5.84 11.14,4.32 11.14,3.47 9.39,1.72 9,1.72 8.51,2.21 3.94,2.21 v3.7,1.97
  Bottom 0.152: U2.40 9.22,15.63 9.22,15.89 9.05,16.06 v9.04,16.06 | AXE.12 5.45,2.38 5.45,2.02 5.3,1.87 3.8,1.87 v3.7,1.97
TXD
  Bottom 0.152: MCU.14 5.68,12.31 6.6,11.39 6.6,11.24 6.94,10.89 7.74,10.89 U2.20 8.06,11.12 8.36,10.82 8.36,10.25 8.17,10.05 8.17,6.75 7.71,6.29 7.71,5.53 6.7,4.51 6.7,4.18 AXE.5
UPDI
  Bottom 0.152: AXE.15 4.67,4.32 4.22,4.77 3.53,4.77 2.51,5.79 2.51,6.69 2.75,6.93 2.75,8.96 2.45,9.25 MCU.23
V_DIODES  (via drill 0.42)
  Top 0.152: v0.83,16.76 0.8,16.73 D8.PLUS
  Bottom 0.152: v0.83,16.76 0.89,16.7 SCHOTTKY.P$1
VBACKUP
  Bottom 0.152: U1.6 5.55,6.75 5.55,6.21 R_RTC.2
VCC  (via drill 0.25)
  Top 0.2: v5.12,5.96 4.93,5.77 3.82,5.77 C_LDO1.2 3.48,5.43 3.48,5.04 3.21,4.77 LDO33.1
  POWER 0.152: v2.18,14.4 v2.18,14.41 2.02,14.57 2.02,15.79 | 2.02,15.79 2.02,17.44 v2.31,17.73 | v4.73,15.55 4.49,15.79 2.02,15.79
  POWER 0.2: v8.85,3.2 8.85,3.59 8.4,4.04
  POWER 0.254: v5.12,5.96 5.62,6.47
  POWER 0.406: v2.18,14.4 2.37,14.21 2.37,9.72 5.62,6.47 8.05,4.04 8.4,4.04 9.36,5 v9.36,5.37
  Bottom 0.152: v5.12,5.96 C_RTC.1 4.58,6.15 4.58,6.83 U1.7 | U5.3 4.83,16.56 5.19,16.2 5.19,15.86 C_BMA1.1 5.22,15.55 v4.73,15.55 | U5.10 2.67,17.73 v2.31,17.73 | v9.36,5.37 9.36,5.45 9.78,5.88 C_BME2.2 9.52,6.25 U3.6 9.52,7.75 10.17,8.41 U3.2
  Bottom 0.2: JP_ON.2 1.7,15.09 2.12,14.67 2.12,14.46 v2.18,14.4 2.12,14.35 1.55,14.35 C_TINY.1 1.35,14.14 1.18,14.14 0.92,13.88 0.92,13.44 0.62,13.14 0.62,12 0.79,11.83 1.23,11.83 MCU.4 | AXE.2 7.47,2.11 7.59,1.99 8.38,1.99 8.78,2.39 8.78,3.13 v8.85,3.2 | v9.36,5.37 9.44,5.37 9.89,4.91 10.95,4.91 11.45,5.42 11.45,6.13 11.22,6.37 11.22,6.81 11.66,7.25 C_TPS.1 11.49,7.45 11.49,8.4 11.65,8.56 U6.A2
VCC_ANNA
  Bottom 0.2: U2.9 12.85,10.81 C_ANNA1.1 12.38,10.04 12.38,9.7 C_ANNA2.1 12.38,9.39 U6.A1
WAKEUP
  Bottom 0.152: MCU.19 4.45,8.16 U1.2

### Text on the board
bPlace: SuperTiny | REV4
tNames: T.R. | Coin Cell + | +3.6V
tDocu: Ear-Tag Housing 22 x 35mm | Alternative power source (no solar): / CR2032, 230mAh, 3g, 3.2mm height / CR2025, 165mAh, 2.28g, 2.5mm height / CR2016, 90mAh, 2g, 1.6mm height / CR1220, 36mAh, 0.8g, 2mm height / CR1216, 25mAh, 0.7g